# Altium schematic sheet ESP8266.SchDoc: µController ESP8266
size 296 x 210 mm; DocumentNumber: 2; SheetNumber: 2; SheetTotal: 4
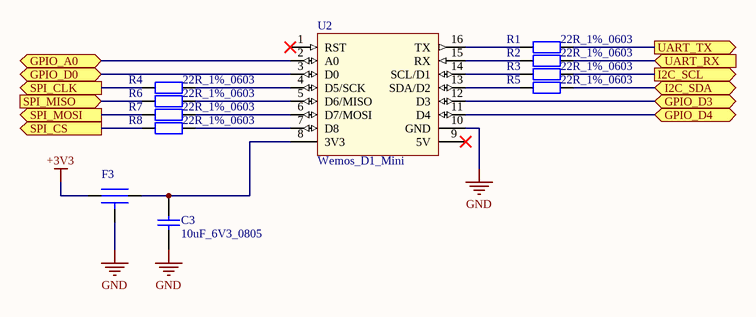
[diagram p0: ESP8266.SchDoc]

## Parts
C3  10uF_6V3_0805  [C0805]
F3  EMI  [EMIFIL_0603]  (value not drawn)
R1  22R_1%_0603  [R0603]
R2  22R_1%_0603  [R0603]
R3  22R_1%_0603  [R0603]
R4  22R_1%_0603  [R0603]
R5  22R_1%_0603  [R0603]
R6  22R_1%_0603  [R0603]
R7  22R_1%_0603  [R0603]
R8  22R_1%_0603  [R0603]
U2  Wemos_D1_Mini  [WEMOS_D1_MINI]

## Ports
GPIO_A0 (bidir), GPIO_D0 (bidir), GPIO_D3 (bidir), GPIO_D4 (bidir), I2C_SCL (out), I2C_SDA (bidir), SPI_CLK (out), SPI_CS (out), SPI_MISO (in), SPI_MOSI (out), UART_RX (in), UART_TX (out)

## Nets
+3V3: F3.2
GND: C3.1 F3.GND U2.10(GND)
GPIO_A0: U2.2(A0) ; port GPIO_A0
GPIO_D0: U2.3(D0) ; port GPIO_D0
GPIO_D3: U2.12(D3) ; port GPIO_D3
GPIO_D4: U2.11(D4) ; port GPIO_D4
I2C_SCL: R3.2 ; port I2C_SCL
I2C_SDA: R5.2 ; port I2C_SDA
SPI_CLK: R4.1 ; port SPI_CLK
SPI_CS: R8.1 ; port SPI_CS
SPI_MISO: R6.1 ; port SPI_MISO
SPI_MOSI: R7.1 ; port SPI_MOSI
UART_RX: R2.2 ; port UART_RX
UART_TX: R1.2 ; port UART_TX
NetC3_2: C3.2 F3.1 U2.8(3V3)
NetR1_1: R1.1 U2.16(TX)
NetR2_1: R2.1 U2.15(RX)
NetR3_1: R3.1 U2.14(SCL/D1)
NetR4_2: R4.2 U2.4(D5/SCK)
NetR5_1: R5.1 U2.13(SDA/D2)
NetR6_2: R6.2 U2.5(D6/MISO)
NetR7_2: R7.2 U2.6(D7/MOSI)
NetR8_2: R8.2 U2.7(D8)

Not connected (* = marked no-connect by the designer): U2 1(RST)* 9(5V)*

## Notes on the sheet
- Verified By :
- Approved By :
- Size:
- Sheet:
- Name:
- A4
- /
- Revision:
- Date:
- Engineer:
- Time:

## Library data of the parts
C3 = Cap: Capacitor; MPN: MCTT21X106M6R3CT; MF: MULTICOMP; Supplier 1: Farnell; Supplier Part Number 1: 1759476; Supplier Pricing 1: 0,28 €
F3 = EMIFIL_0603: FILTER CAP 0.1UF 2A 16V 0603; MPN: NFM18PC104R1C3D; MF: MURATA; Supplier 1: Farnell; Supplier Part Number 1: 1686508; Supplier Pricing 1: 0,083 €
R1-R8 = RES: Resistor; MPN: MCWR06X22R0FTL; MF: Multicomp; Supplier Pricing 1: 0,0056€; Supplier Part Number 1: 2447301; Supplier 1: Farnell
U2 = ESP8266: MF: *; MPN: *; Supplier 1: *; Supplier Pricing 1: *; Supplier Part Number 1: *